# Altium schematic sheet Power_supply.SchDoc: SVPXFMC Carrier 3U
size A2; CheckedBy: \; Author: G.Kasprowicz; CompanyName: ISE; DrawnBy: T.Przywozki; Organization: WUT ISE; Address1: Warsaw University of Technology; Address2: Nowowiejska 15/19 00-665 Warsaw; Revision: 1.0.; SheetNumber: 2; SheetTotal: 20; Projet: SVPXFMC Carrier 3U; ModifiedBy: -; CheckedDate: -; Title2: Power Supply; DivGrp: ISE; Designer: G.Kasprowicz; Project: SVPXFMC Carrier 3U
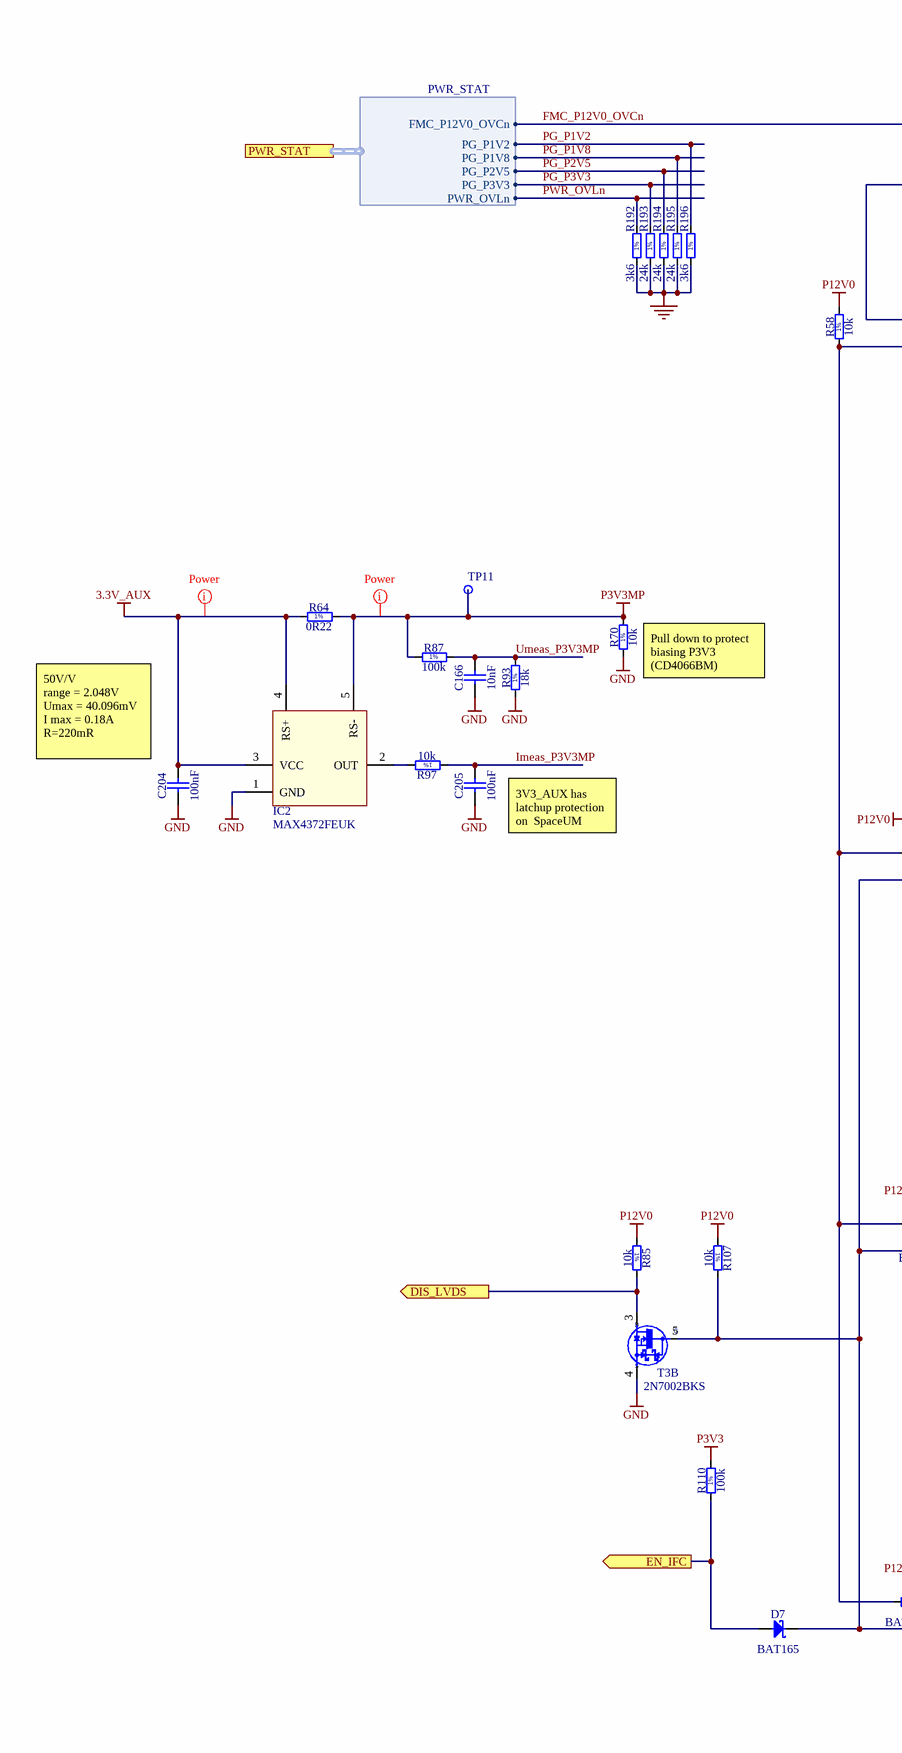
[diagram p0: Power_supply.SchDoc, left]
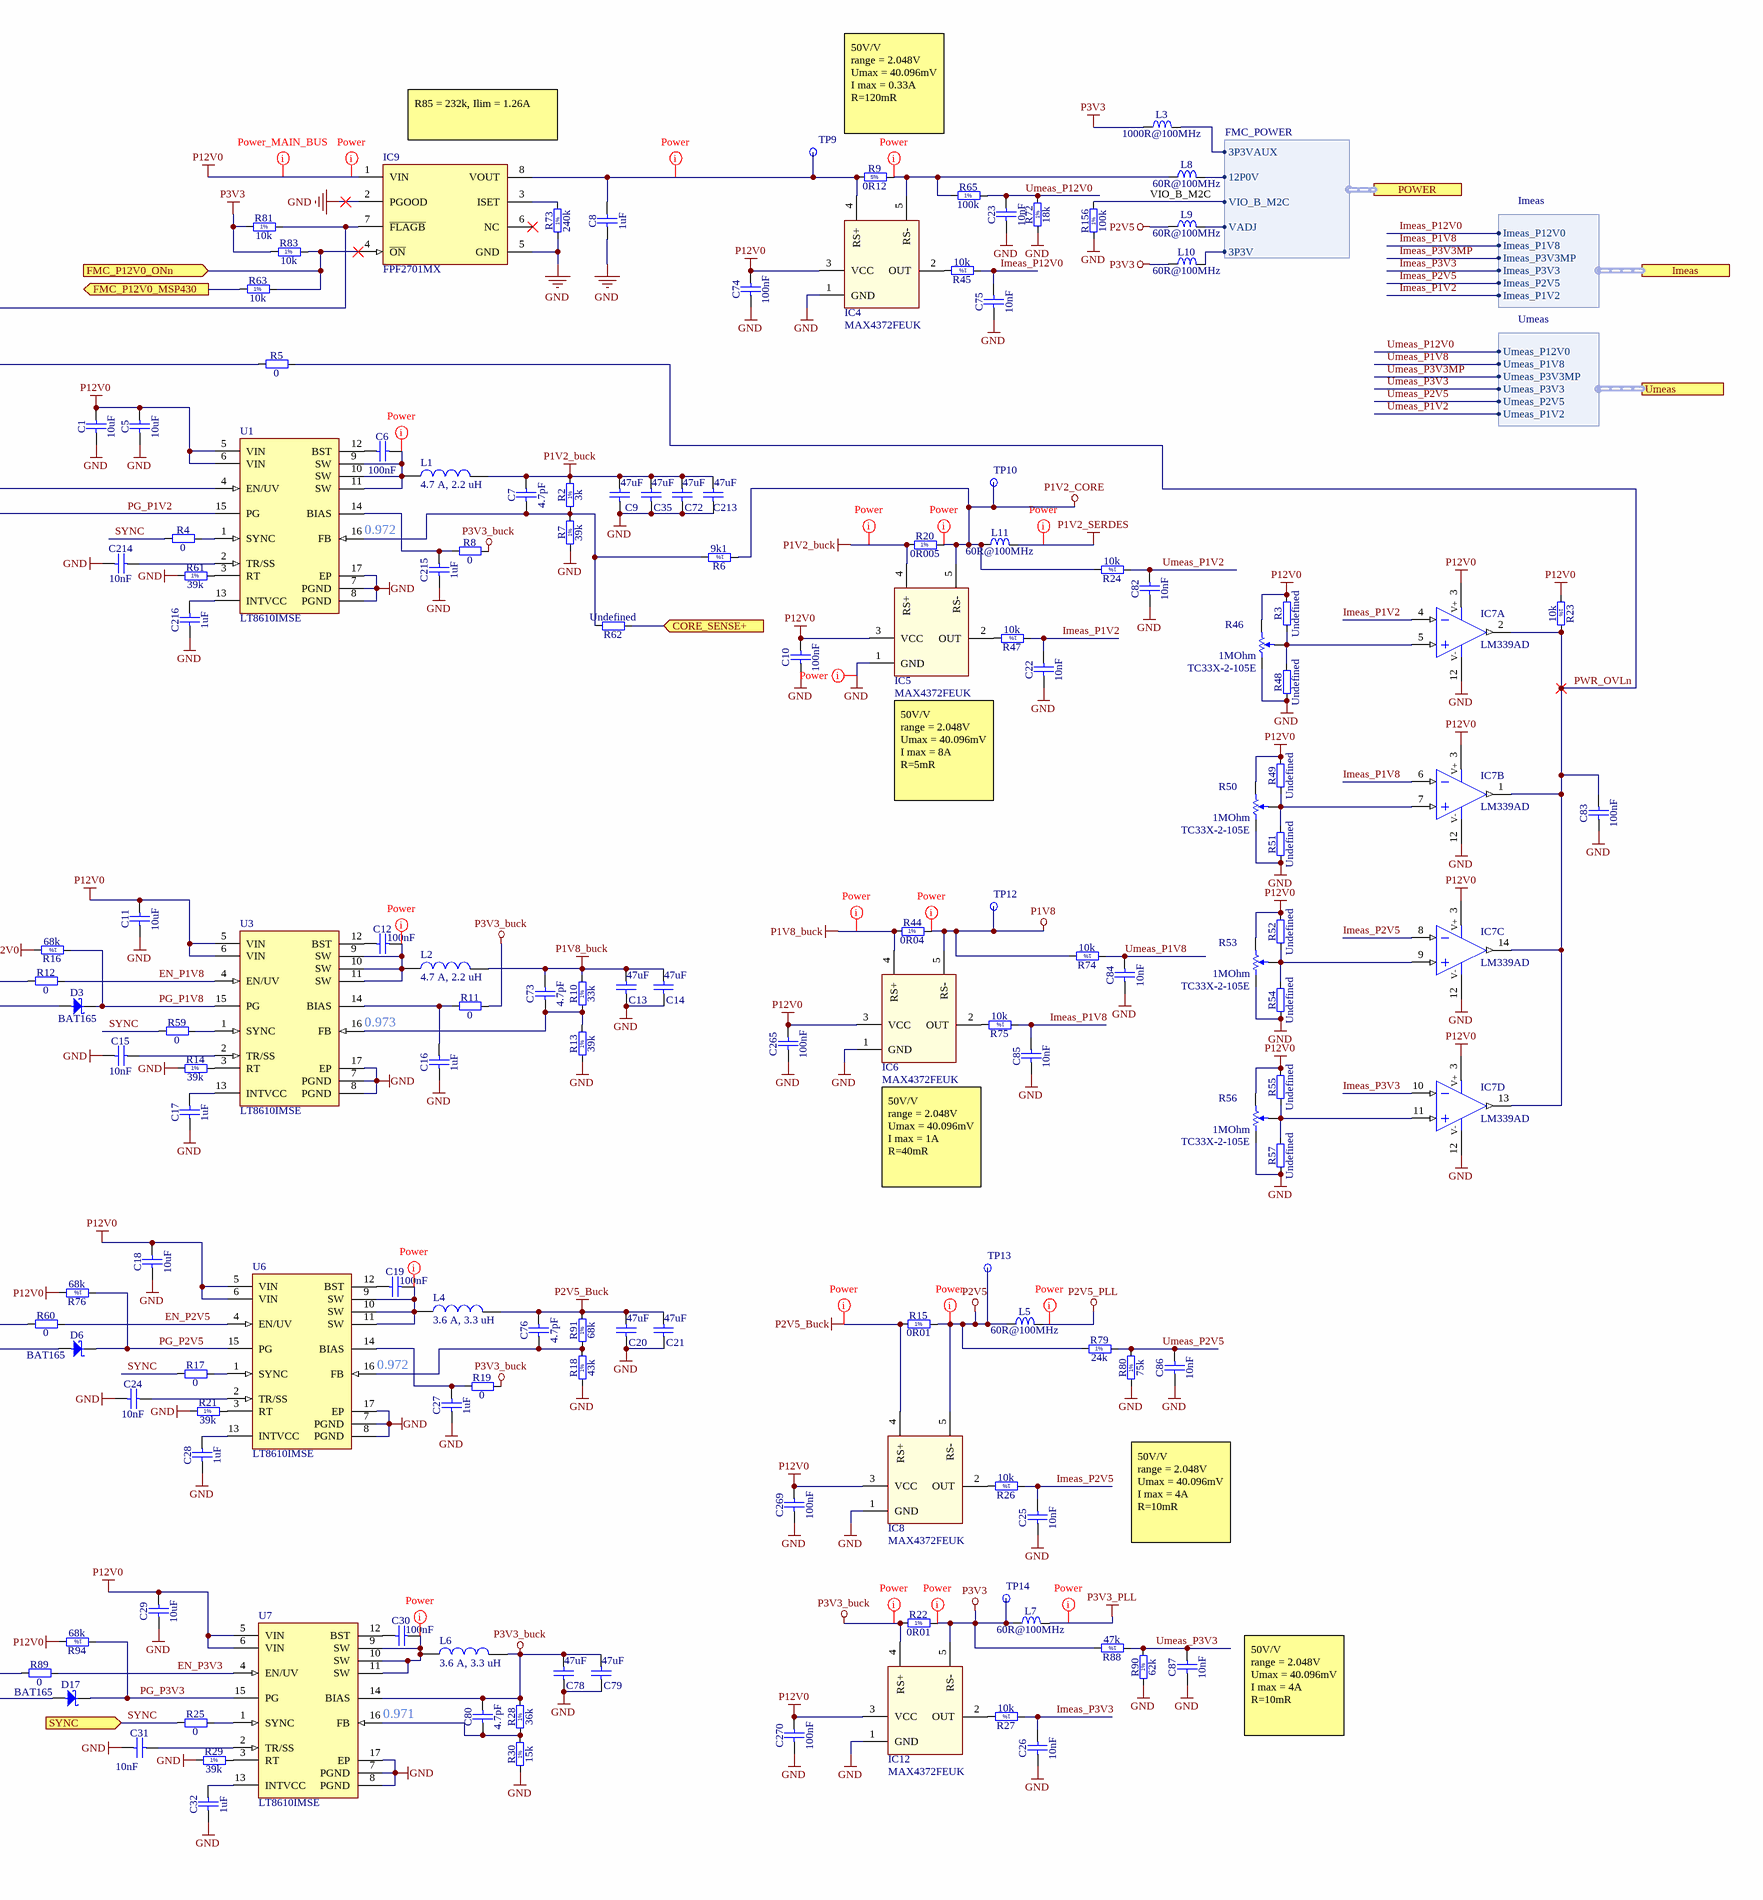
[diagram p1: Power_supply.SchDoc, right]

## Parts
C1  10uF  [CAPC2012X95N]
C5  10uF  [CAPC2012X95N]
C6  100nF  [CAPC1005X55N]
C7  4.7pF  [CAPC1005X55N]
C8  1uF  [CAPC1608X87N]
C9  47uF  [CAPC2012X140N]
C10  100nF  [CAPC1005X55N]
C11  10uF  [CAPC2012X95N]
C12  100nF  [CAPC1005X55N]
C13  47uF  [CAPC2012X140N]
C14  47uF  [CAPC2012X140N]
C15  10nF  [CAPC1005X55N]
C16  1uF  [CAPC1608X87N]
C17  1uF  [CAPC1608X87N]
C18  10uF  [CAPC2012X95N]
C19  100nF  [CAPC1005X55N]
C20  47uF  [CAPC2012X140N]
C21  47uF  [CAPC2012X140N]
C22  10nF  [CAPC1005X55N]
C23  10nF  [CAPC1005X55N]
C24  10nF  [CAPC1005X55N]
C25  10nF  [CAPC1005X55N]
C26  10nF  [CAPC1005X55N]
C27  1uF  [CAPC1608X87N]
C28  1uF  [CAPC1608X87N]
C29  10uF  [CAPC2012X95N]
C30  100nF  [CAPC1005X55N]
C31  10nF  [CAPC1005X55N]
C32  1uF  [CAPC1608X87N]
C35  47uF  [CAPC2012X140N]
C72  47uF  [CAPC2012X140N]
C73  4.7pF  [CAPC1005X55N]
C74  100nF  [CAPC1005X55N]
C75  10nF  [CAPC1005X55N]
C76  4.7pF  [CAPC1005X55N]
C78  47uF  [CAPC2012X140N]
C79  47uF  [CAPC2012X140N]
C80  4.7pF  [CAPC1005X55N]
C82  10nF  [CAPC1005X55N]
C83  100nF  [CAPC1005X55N]
C84  10nF  [CAPC1005X55N]
C85  10nF  [CAPC1005X55N]
C86  10nF  [CAPC1005X55N]
C87  10nF  [CAPC1005X55N]
C166  10nF  [CAPC1005X55N]
C204  100nF  [CAPC1005X55N]
C205  100nF  [CAPC1005X55N]
C213  47uF  [CAPC2012X140N]
C214  10nF  [CAPC1005X55N]
C215  1uF  [CAPC1608X87N]
C216  1uF  [CAPC1608X87N]
C265  100nF  [CAPC1005X55N]
C269  100nF  [CAPC1005X55N]
C270  100nF  [CAPC1005X55N]
D3  BAT165  [SOD2512X110N]
D6  BAT165  [SOD2512X110N]
D7  BAT165  [SOD2512X110N]
D17  BAT165  [SOD2512X110N]
IC2  MAX4372FEUK  [SOT95P270X145-5N]
IC4  MAX4372FEUK  [SOT95P270X145-5N]
IC5  MAX4372FEUK  [SOT95P270X145-5N]
IC6  MAX4372FEUK  [SOT95P270X145-5N]
IC7  LM339AD  [SOIC127P600X175-14N]  (parts A,B,C,D of 4)
IC8  MAX4372FEUK  [SOT95P270X145-5N]
IC9  FPF2701MX  [SOIC127P600X175-8N]
IC12  MAX4372FEUK  [SOT95P270X145-5N]
L1  4.7 A, 2.2 uH  [WE-MAIA_4020]
L2  4.7 A, 2.2 uH  [WE-MAIA_4020]
L3  1000R@100MHz  [INDC1608X95N]
L4  3.6 A, 3.3 uH  [WE-MAIA_4020]
L5  60R@100MHz  [INDC4516X180N]
L6  3.6 A, 3.3 uH  [WE-MAIA_4020]
L7  60R@100MHz  [INDC4516X180N]
L8  60R@100MHz  [INDC4516X180N]
L9  60R@100MHz  [INDC4516X180N]
L10  60R@100MHz  [INDC4516X180N]
L11  60R@100MHz  [INDC4516X180N]
R2  3k  [RESC1005X40N]
R3  Undefined  [RESC1005X40N]
R4  0  [RESC1005X40N]
R5  0  [RESC1005X40N]
R6  9k1  [RESC1005X40N]
R7  39k  [RESC1005X40N]
R8  0  [RESC1005X40N]
R9  0R12  [RESC2012X70N]
R10  33k  [RESC1005X40N]
R11  0  [RESC1005X40N]
R12  0  [RESC1005X40N]
R13  39k  [RESC1005X40N]
R14  39k  [RESC1005X40N]
R15  0R01  [RESC3216X80N]
R16  68k  [RESC1005X40N]
R17  0  [RESC1005X40N]
R18  43k  [RESC1005X40N]
R19  0  [RESC1005X40N]
R20  0R005  [RESC3216X80N]
R21  39k  [RESC1005X40N]
R22  0R01  [RESC3216X80N]
R23  10k  [RESC1005X40N]
R24  10k  [RESC1005X40N]
R25  0  [RESC1005X40N]
R26  10k  [RESC1005X40N]
R27  10k  [RESC1005X40N]
R28  36k  [RESC1005X40N]
R29  39k  [RESC1005X40N]
R30  15k  [RESC1005X40N]
R44  0R04  [RESC3216X89N]
R45  10k  [RESC1005X40N]
R46  TC33X-2-105E  Resistance: 1MOhm  [BOUR-TC33X-2_V]
R47  10k  [RESC1005X40N]
R48  Undefined  [RESC1005X40N]
R49  Undefined  [RESC1005X40N]
R50  TC33X-2-105E  Resistance: 1MOhm  [BOUR-TC33X-2_V]
R51  Undefined  [RESC1005X40N]
R52  Undefined  [RESC1005X40N]
R53  TC33X-2-105E  Resistance: 1MOhm  [BOUR-TC33X-2_V]
R54  Undefined  [RESC1005X40N]
R55  Undefined  [RESC1005X40N]
R56  TC33X-2-105E  Resistance: 1MOhm  [BOUR-TC33X-2_V]
R57  Undefined  [RESC1005X40N]
R58  10k  [RESC1005X40N]
R59  0  [RESC1005X40N]
R60  0  [RESC1005X40N]
R61  39k  [RESC1005X40N]
R62  Undefined  [RESC1005X40N]
R63  10k  [RESC1005X40N]
R64  0R22  [RESC3216X70N]
R65  100k  [RESC1005X40N]
R70  10k  [RESC1005X40N]
R72  18k  [RESC1005X40N]
R73  240k  [RESC1005X40N]
R74  10k  [RESC1005X40N]
R75  10k  [RESC1005X40N]
R76  68k  [RESC1005X40N]
R79  24k  [RESC1005X40N]
R80  75k  [RESC1005X40N]
R81  10k  [RESC1005X40N]
R83  10k  [RESC1005X40N]
R85  10k  [RESC1005X40N]
R87  100k  [RESC1005X40N]
R88  47k  [RESC1005X40N]
R89  0  [RESC1005X40N]
R90  62k  [RESC1005X40N]
R91  68k  [RESC1005X40N]
R93  18k  [RESC1005X40N]
R94  68k  [RESC1005X40N]
R97  10k  [RESC1005X40N]
R107  10k  [RESC1005X40N]
R110  100k  [RESC1005X40N]
R156  100k  [RESC1005X40N]
R192  3k6  [RESC1005X40N]
R193  24k  [RESC1005X40N]
R194  24k  [RESC1005X40N]
R195  24k  [RESC1005X40N]
R196  3k6  [RESC1005X40N]
T3  2N7002BKS  [SOT65P210X110-6N]  (part B of 2)
TP9  Test Point  [TPS127]  (value not drawn)
TP10  Test Point  [TPS127]  (value not drawn)
TP11  Test Point  [TPS127]  (value not drawn)
TP12  Test Point  [TPS127]  (value not drawn)
TP13  Test Point  [TPS127]  (value not drawn)
TP14  Test Point  [TPS127]  (value not drawn)
U1  LT8610IMSE  [LT-MSE-16-EDP_L]
U3  LT8610IMSE  [LT-MSE-16-EDP_L]
U6  LT8610IMSE  [LT-MSE-16-EDP_L]
U7  LT8610IMSE  [LT-MSE-16-EDP_L]

## Ports
CORE_SENSE+ (in), DIS_LVDS (out), EN_IFC (out), FMC_P12V0_MSP430 (out), FMC_P12V0_ONn (in), Imeas (harness Imeas), POWER (harness FMC_POWER), PWR_STAT (harness PWR_STAT), SYNC (in), Umeas (harness Umeas)

## Harnesses
Imeas: Imeas_P12V0, Imeas_P1V8, Imeas_P3V3, Imeas_P2V5, Imeas_P1V2, Imeas_P3V3MP
FMC_POWER: 3P3VAUX, 12P0V, VIO_B_M2C, VADJ, 3P3V
PWR_STAT: FMC_P12V0_OVCn, PG_P1V2, PG_P1V8, PG_P2V5, PG_P3V3, PWR_OVLn
Umeas: Umeas_P12V0, Umeas_P1V8, Umeas_P3V3, Umeas_P2V5, Umeas_P1V2, Umeas_P3V3MP

## Nets
3.3V_AUX: C204.2 IC2.3(VCC) IC2.4(RS+) R64.1
GND: C1.1 C5.1 C8.1 C9.1 C10.1 C11.1 C13.1 C14.1 C15.1 C16.1 C17.1 C18.1 C20.1 C21.1 C22.1 C23.1 C24.1 C25.1 C26.1 C27.1 C28.1 C29.1 C31.1 C32.1 C35.1 C72.1 C74.1 C75.1 C78.1 C79.1 C82.1 C83.1 C84.1 C85.1 C86.1 C87.1 C166.1 C204.1 C205.1 C213.1 C214.1 C215.1 C216.1 C265.1 C269.1 C270.1 IC2.1(GND) IC4.1(GND) IC5.1(GND) IC6.1(GND) IC7.12(V-) IC8.1(GND) IC9.2(PGOOD) IC9.5(GND) IC12.1(GND) R7.1 R13.1 R14.1 R18.1 R21.1 R29.1 R30.1 R46.1 R48.1 R50.1 R51.1 R53.1 R54.1 R56.1 R57.1 R61.1 R70.1 R72.1 R73.1 R80.1 R90.1 R93.1 R156.1 R192.1 R193.1 R194.1 R195.1 R196.1 T3.4(S) U1.7(PGND) U1.8(PGND) U1.17(EP) U3.7(PGND) U3.8(PGND) U3.17(EP) U6.7(PGND) U6.8(PGND) U6.17(EP) U7.7(PGND) U7.8(PGND) U7.17(EP)
P1V2_buck: C7.2 C9.2 C35.2 C72.2 C213.2 IC5.4(RS+) L1.2 R2.2 R20.1
P1V2_CORE: IC5.5(RS-) L11.1 R6.1 R20.2 R24.2 TP10.1
P1V2_SERDES: L11.2
P1V8: IC6.5(RS-) R44.2 R74.2 TP12.1
P1V8_buck: C13.2 C14.2 C73.2 IC6.4(RS+) L2.2 R10.2 R44.1
P2V5: IC8.5(RS-) L5.1 L9.1 R15.2 R79.1 TP13.1
P2V5_Buck: C20.2 C21.2 C76.2 IC8.4(RS+) L4.2 R15.1 R91.2
P2V5_PLL: L5.2
P3V3: IC12.5(RS-) L3.1 L7.1 L10.1 R22.2 R81.1 R83.1 R88.2 R110.2 TP14.1
P3V3_buck: C78.2 C79.2 C80.2 IC12.4(RS+) L6.2 R8.2 R11.2 R19.2 R22.1 R28.2 U7.14(BIAS)
P3V3_PLL: L7.2
P3V3MP: IC2.5(RS-) R64.2 R70.2 R87.1 TP11.1
P12V0: C1.2 C5.2 C10.2 C11.2 C18.2 C29.2 C74.2 C265.2 C269.2 C270.2 IC4.3(VCC) IC5.3(VCC) IC6.3(VCC) IC7.3(V+) IC8.3(VCC) IC9.1(VIN) IC12.3(VCC) R3.2 R16.2 R23.1 R46.3 R49.2 R50.3 R52.2 R53.3 R55.2 R56.3 R58.2 R76.2 R85.1 R94.2 R107.1 U1.5(VIN) U1.6(VIN) U3.5(VIN) U3.6(VIN) U6.5(VIN) U6.6(VIN) U7.5(VIN) U7.6(VIN)
CORE_SENSE+: R62.1 ; port CORE_SENSE+
DIS_LVDS: R85.2 T3.3(D) ; port DIS_LVDS
EN_IFC: D7.2(A) R110.1 ; port EN_IFC
EN_P1V8: R12.2 U3.4(EN/UV)
EN_P2V5: R60.2 U6.4(EN/UV)
EN_P3V3: R89.2 U7.4(EN/UV)
FMC_P12V0_MSP430: R63.1 ; port FMC_P12V0_MSP430
FMC_P12V0_ONn: IC9.4(~{ON}) R63.2 R83.2 ; port FMC_P12V0_ONn
FMC_P12V0_OVCn: IC9.7(~{FLAGB}) R81.2 ; port PWR_STAT.FMC_P12V0_OVCn
Imeas_P1V2: C22.2 IC7.4(IN-) R47.1 ; port Imeas.Imeas_P1V2
Imeas_P1V8: C85.2 IC7.6(IN-) R75.1 ; port Imeas.Imeas_P1V8
Imeas_P2V5: C25.2 IC7.8(IN-) R26.1 ; port Imeas.Imeas_P2V5
Imeas_P3V3: C26.2 IC7.10(IN-) R27.1 ; port Imeas.Imeas_P3V3
Imeas_P3V3MP: C205.2 R97.1 ; port Imeas.Imeas_P3V3MP
Imeas_P12V0: C75.2 R45.1 ; port Imeas.Imeas_P12V0
PG_P1V2: R12.1 R58.1 R60.1 R89.1 R196.2 U1.15(PG) ; port PWR_STAT.PG_P1V2
PG_P1V8: D3.1(C) R16.1 R195.2 U3.15(PG) ; port PWR_STAT.PG_P1V8
PG_P2V5: D6.1(C) R76.1 R194.2 U6.15(PG) ; port PWR_STAT.PG_P2V5
PG_P3V3: D17.1(C) R94.1 R193.2 U7.15(PG) ; port PWR_STAT.PG_P3V3
PWR_OVLn: C83.2 IC7.1(OUT) IC7.2(OUT) IC7.13(OUT) IC7.14(OUT) R5.2 R23.2 R192.2 ; port PWR_STAT.PWR_OVLn
SYNC: R4.1 R17.1 R25.1 R59.1 ; port SYNC
Umeas_P1V2: C82.2 R24.1 ; port Umeas.Umeas_P1V2
Umeas_P1V8: C84.2 R74.1 ; port Umeas.Umeas_P1V8
Umeas_P2V5: C86.2 R79.2 R80.2 ; port Umeas.Umeas_P2V5
Umeas_P3V3: C87.2 R88.1 R90.2 ; port Umeas.Umeas_P3V3
Umeas_P3V3MP: C166.2 R87.2 R93.2 ; port Umeas.Umeas_P3V3MP
Umeas_P12V0: C23.2 R65.2 R72.2 ; port Umeas.Umeas_P12V0
VIO_B_M2C: R156.2 ; port POWER.VIO_B_M2C
NetC6_1: C6.1 U1.12(BST)
NetC6_2: C6.2 L1.1 U1.9(SW) U1.10(SW) U1.11(SW)
NetC7_1: C7.1 R2.1 R6.2 R7.2 R62.2 U1.16(FB)
NetC8_2: C8.2 IC4.4(RS+) IC9.8(VOUT) R9.1 TP9.1
NetC12_1: C12.1 U3.12(BST)
NetC12_2: C12.2 L2.1 U3.9(SW) U3.10(SW) U3.11(SW)
NetC15_2: C15.2 U3.2(TR/SS)
NetC16_2: C16.2 R11.1 U3.14(BIAS)
NetC17_2: C17.2 U3.13(INTVCC)
NetC19_1: C19.1 U6.12(BST)
NetC19_2: C19.2 L4.1 U6.9(SW) U6.10(SW) U6.11(SW)
NetC24_2: C24.2 U6.2(TR/SS)
NetC27_2: C27.2 R19.1 U6.14(BIAS)
NetC28_2: C28.2 U6.13(INTVCC)
NetC30_1: C30.1 U7.12(BST)
NetC30_2: C30.2 L6.1 U7.9(SW) U7.10(SW) U7.11(SW)
NetC31_2: C31.2 U7.2(TR/SS)
NetC32_2: C32.2 U7.13(INTVCC)
NetC73_1: C73.1 R10.1 R13.2 U3.16(FB)
NetC76_1: C76.1 R18.2 R91.1 U6.16(FB)
NetC80_1: C80.1 R28.1 R30.2 U7.16(FB)
NetC214_2: C214.2 U1.2(TR/SS)
NetC215_2: C215.2 R8.1 U1.14(BIAS)
NetC216_2: C216.2 U1.13(INTVCC)
NetD3_2: D3.2(A) D6.2(A) D7.1(C) D17.2(A) R107.2 T3.5(G)
NetIC2_2: IC2.2(OUT) R97.2
NetIC4_2: IC4.2(OUT) R45.2
NetIC4_5: IC4.5(RS-) L8.1 R9.2 R65.1
NetIC5_2: IC5.2(OUT) R47.2
NetIC6_2: IC6.2(OUT) R75.2
NetIC7_5: IC7.5(IN+) R3.1 R46.2 R48.2
NetIC7_7: IC7.7(IN+) R49.1 R50.2 R51.2
NetIC7_9: IC7.9(IN+) R52.1 R53.2 R54.2
NetIC7_11: IC7.11(IN+) R55.1 R56.2 R57.2
NetIC8_2: IC8.2(OUT) R26.2
NetIC9_3: IC9.3(ISET) R73.2
NetIC12_2: IC12.2(OUT) R27.2
NetL3_2: L3.2 ; port POWER.3P3VAUX
NetL8_2: L8.2 ; port POWER.12P0V
NetL9_2: L9.2 ; port POWER.VADJ
NetL10_2: L10.2 ; port POWER.3P3V
NetR4_2: R4.2 U1.1(SYNC)
NetR5_1: R5.1 U1.4(EN/UV)
NetR14_2: R14.2 U3.3(RT)
NetR17_2: R17.2 U6.1(SYNC)
NetR21_2: R21.2 U6.3(RT)
NetR25_2: R25.2 U7.1(SYNC)
NetR29_2: R29.2 U7.3(RT)
NetR59_2: R59.2 U3.1(SYNC)
NetR61_2: R61.2 U1.3(RT)

Not connected (* = marked no-connect by the designer): IC9 6(NC)*

## Layout directives
net class Power: 3.3V_AUX, GND, NetC6_2, NetC8_2, NetC12_2, NetC19_2, NetC30_2, NetIC4_5, P1V2_buck, P1V2_CORE, P1V2_SERDES, P1V8, P1V8_buck, P2V5, P2V5_Buck, P2V5_PLL, P3V3, P3V3_buck, P3V3_PLL, P3V3MP, P12V0
net class Power_MAIN_BUS: P12V0

## Notes on the sheet
- 50V/V
  range = 2.048V
  Umax = 40.096mV
  I max = 0.33A
  R=120mR
- (near IC9) R85 = 232k, Ilim = 1.26A
- (near U1) 0.972
- (near R70) Pull down to protect biasing P3V3 (CD4066BM)
- 50V/V
  range = 2.048V
  Umax = 40.096mV
  I max = 8A
  R=5mR
- (near C204) 50V/V
  range = 2.048V
  Umax = 40.096mV
  I max = 0.18A
  R=220mR
- (near C205) 3V3_AUX has latchup protection on  SpaceUM
- (near U3) 0.973
- 50V/V
  range = 2.048V
  Umax = 40.096mV
  I max = 1A
  R=40mR
- (near U6) 0.972
- 50V/V
  range = 2.048V
  Umax = 40.096mV
  I max = 4A
  R=10mR
- (near U7) 0.971
- Project/Equipment
- Document
- Designer
- Drawn by
- Check.by
- Last Mod.
- Copyright WUT ISE 2019
  This documentation describes Open Hardware and is licensed under the CERN OHL v.1.1. You may redistribute and modify this documentation under the terms of the CERN OHL v1.1.
  (http://ohwr.org/CERNOHL). This documentation is dristributed WITHOUT ANY EXPRESS OR IMPLIED WARRANTY, INCLUDING OF MERCHANTABILITY, SATISFACTORY QUALITY AND FITNESS FOR A PARTICULAR PURPOSE. Please see the CERN OHL v.1.1 for applicable conditions
- File
- Print Date
- Sheet
- Size
- A2
- of
- Rev
- (in symbol R0402_3K6_1%_0.0625W_100PPM) 1%
- (in symbol R0402_3K_1%_0.0625W_100PPM) 1%
- (in symbol R0402_9K1_1%_0.0625W_100PPM) 1%
- (in symbol R0402_10K_1%_0.0625W_100PPM) 1%
- (in symbol R0402_15K_1%_0.0625W_100PPM) 1%
- (in symbol R0402_18K_1%_0.0625W_100PPM) 1%
- (in symbol R0402_24K_1%_0.0625W_100PPM) 1%
- (in symbol R0402_33K_1%_0.0625W_100PPM) 1%
- (in symbol R0402_36K_1%_0.0625W_100PPM) 1%
- (in symbol R0402_39K_1%_0.0625W_100PPM) 1%
- (in symbol R0402_43K_1%_0.0625W_100PPM) 1%
- (in symbol R0402_47K_1%_0.0625W_100PPM) 1%
- (in symbol R0402_62K_1%_0.0625W_100PPM) 1%
- (in symbol R0402_68K_1%_0.0625W_100PPM) 1%
- (in symbol R0402_75K_1%_0.0625W_100PPM) 1%
- (in symbol R0402_100K_1%_0.0625W_100PPM) 1%
- (in symbol R0402_240K_1%_0.0625W_100PPM) 1%
- (in symbol R0805_0R12_5%_0.25W_250PPM_PANASONIC_ERJ) 5%
- (in symbol R1206_0R01_1%_1W_100PPM_TT_LRMAM1206) 1%
- (in symbol R1206_0R04_1%_0.5W_100PPM_VISHAY_WSL) 1%
- (in symbol R1206_0R005_1%_1W_100PPM_TT_LRMAM1206) 1%
- (in symbol R1206_0R22_1%_0.5W_100PPM) 1%

## Library data of the parts
C1 C5 C11 C18 C29 = CC0805_10UF_25V_10%_X5R: Non-polarised capacitor; Part Description: SMD Multilayer Chip Ceramic Capacitor; Manufacturer: GENERIC; Manufacturer1 Part Number: GRM219R61E106KA12D; Voltage: 25V; TC: X5R; Tolerance: ±10%; Part Number: CC0805_10UF_25V_10%_X5R; Component Kind: Standard; Component Type: Standard; Pin Count: 2; Value: 10uF; Status: Preferred; Manufacturer Part Number: CC0805_10UF_25V_10%_X5R; Case: 0805; Mounted: Yes; Socket: No; SMD: Yes; Sense: No; Manufacturer1 Example: MURATA; Manufacturer1 ComponentHeight: 0.95mm; HelpURL: \\cern.ch\dfs\Applications\Altium\Datasheets\CC0805_X5R_MURATA_GRM.pdf; Author: CERN DEM JLC; CreateDate: 25/10/2012; LatestRevisionDate: 06/09/2016
C6 C10 C12 C19 C30 C74 C83 C204 C205 C265 C269 C270 = CC0402_100NF_25V_10%_X7R_YUDEN_TMK105B7104KVHF: Non-polarised capacitor; Part Description: SMD Multilayer Chip Ceramic Capacitor (High Dielectric Type) for Automotive / Industrial Applications; Manufacturer: TAIYO YUDEN; Voltage: 25V; TC: X7R; Tolerance: ±10%; Part Number: CC0402_100NF_25V_10%_X7R_YUDEN_TMK105B7104KVHF; Component Kind: Standard; Component Type: Standard; Pin Count: 2; Value: 100nF; Status: Not Recommended; Manufacturer Part Number: TMK105B7104KVHF; Case: 0402; Mounted: Yes; Socket: No; SMD: Yes; Sense: No; ComponentHeight: 0.55mm; HelpURL: \\cern.ch\dfs\Applications\Altium\Datasheets\CC0402_TAIYO-YUDEN_TMK105B7104KVHF.pdf; Author: CERN DEM JLC; CreateDate: 10/05/2017; LatestRevisionDate: 10/05/2017
C7 C73 C76 C80 = CC0402_4.7PF_50V_0.25PF_C0G: Non-polarised capacitor; Part Description: SMD Multilayer Chip Ceramic Capacitor; Manufacturer: GENERIC; Manufacturer1 Part Number: C0402C479C5GACTU; Voltage: 50V; TC: C0G/NP0; Tolerance: ±0.25pF; Part Number: CC0402_4.7PF_50V_0.25PF_C0G; Component Kind: Standard; Component Type: Standard; Pin Count: 2; Value: 4.7pF; Status: Preferred; Manufacturer Part Number: CC0402_4.7PF_50V_0.25PF_C0G; Case: 0402; Mounted: Yes; Socket: No; SMD: Yes; Sense: No; Manufacturer1 Example: KEMET; Manufacturer1 ComponentHeight: 0.55mm; HelpURL: \\cern.ch\dfs\Applications\Altium\Datasheets\CC0805_C0G_KEMET_(Commercial Grade).pdf; Author: CERN DEM JLC; CreateDate: 03/12/2007; LatestRevisionDate: 22/04/2015
C8 C16 C17 C27 C28 C32 C215 C216 = CC0603_1UF_25V_10%_X7R: Non-polarised capacitor; Part Description: SMD Multilayer Chip Ceramic Capacitor; Manufacturer: GENERIC; Manufacturer1 Part Number: GRM188R71E105KA12D; Voltage: 25V; TC: X7R; Tolerance: ±10%; Part Number: CC0603_1UF_25V_10%_X7R; Component Kind: Standard; Component Type: Standard; Pin Count: 2; Value: 1uF; Status: None; Manufacturer Part Number: CC0603_1UF_25V_10%_X7R; Case: 0603; Mounted: Yes; Socket: No; SMD: Yes; Sense: No; Manufacturer1 Example: MURATA; Manufacturer1 ComponentHeight: 0.9mm; HelpURL: \\cern.ch\dfs\Applications\Altium\Datasheets\CC0603_X7R_MURATA.pdf; Author: CERN DEM JLC; CreateDate: 18/01/2011; LatestRevisionDate: 18/01/2011
C9 C13 C14 C20 C21 C35 C72 C78 C79 C213 = CC0805_47UF_6.3V_20%_X5R: Non-polarised capacitor; Manufacturer: GENERIC; Part Description: SMD Multilayer Chip Ceramic Capacitor; Manufacturer1 Part Number: C0805C476M9PACTU; Voltage: 6.3V; TC: X5R; Tolerance: ±20%; Part Number: CC0805_47UF_6.3V_20%_X5R; Component Kind: Standard; Component Type: Standard; Pin Count: 2; Value: 47uF; Status: Preferred; Manufacturer Part Number: CC0805_47UF_6.3V_20%_X5R; Case: 0805; Mounted: Yes; Socket: No; SMD: Yes; Sense: No; Manufacturer1 Example: KEMET; Manufacturer1 ComponentHeight: 1.4mm; HelpURL: \\cern.ch\dfs\Applications\Altium\Datasheets\CC0805_X5R_KEMET.pdf; Author: CERN DEM JLC; CreateDate: 16/10/2012; LatestRevisionDate: 16/10/2012
C15 C24 C31 C214 = CC0402_10NF_25V_10%_X7R: Non-polarised capacitor; Part Description: SMD Multilayer Chip Ceramic Capacitor; Manufacturer: GENERIC; Manufacturer1 Part Number: C1005X7R1E103KT; Voltage: 25V; TC: X7R; Tolerance: ±10%; Part Number: CC0402_10NF_25V_10%_X7R; Component Kind: Standard; Component Type: Standard; Pin Count: 2; Value: 10nF; Status: Preferred; Manufacturer Part Number: CC0402_10NF_25V_10%_X7R; Case: 0402; Mounted: Yes; Socket: No; SMD: Yes; Sense: No; Manufacturer1 Example: TDK; Manufacturer1 ComponentHeight: 0.55mm; HelpURL: \\cern.ch\dfs\Applications\Altium\Datasheets\CC0402_X7R_TDK_C.pdf; Author: CERN DEM JLC; CreateDate: 25/10/2012; LatestRevisionDate: 25/10/2012
C22 C23 C25 C26 C75 C82 C84-C87 C166 = CC0402_10NF_50V_10%_X7R: Non-polarised capacitor; Part Description: SMD Multilayer Chip Ceramic Capacitor; Manufacturer: GENERIC; Manufacturer1 Part Number: GRM155R71H103KA88D; Voltage: 50V; TC: X7R; Tolerance: ±10%; Part Number: CC0402_10NF_50V_10%_X7R; Component Kind: Standard; Component Type: Standard; Pin Count: 2; Value: 10nF; Status: None; Manufacturer Part Number: CC0402_10NF_50V_10%_X7R; Case: 0402; Mounted: Yes; Socket: No; SMD: Yes; Sense: No; Manufacturer1 Example: MURATA; Manufacturer1 ComponentHeight: 0.55mm; HelpURL: \\cern.ch\dfs\Applications\Altium\Datasheets\CC0402_X7R_MURATA_GRM.pdf; Author: CERN DEM MR; CreateDate: 08/01/2016; LatestRevisionDate: 08/01/2016
D3 D6 D7 D17 = BAT165: Schottky Diode; Part Description: Medium Power AF Schottky Diode; Manufacturer: INFINEON; Voltage: 40V; Power: 750mA; PressFit: No; Bonding: No; Part Number: BAT165; Component Kind: Standard; Component Type: Standard; Device: BAT165; PackageDescription: Small Outline Diode Flat Lead (SOD-323), 1.70mm W X 1.25mm L X 1.10mm H body,  IPC Medium Density; Manufacturer Part Number: BAT165; Pin Count: 2; Case: SOD323; Mounted: Yes; Socket: No; SMD: Yes; Sense: No; ComponentHeight: 1.1mm; HelpURL: \\cern.ch\dfs\Applications\Altium\Datasheets\BAT165.pdf; Author: CERN DEM JLC; CreateDate: 2014-11-12; LatestRevisionDate: 2014-11-12
IC2 = MAX4372FEUK: High side current sense amplifier (x50); Manufacturer: Maxim; Bonding: No; PressFit: No; Case: SOT23-5; Component Kind: Standard; Component Type: Standard; ComponentHeigth: *; CreateDate: 2018-01-01; Device: MAX4372FEUK; Footprint: SOT23-5; HelpURL: *; LatestRevisionDate: 2018-01-01; Manufacturer Part Number: MAX4372FEUK; Mounted: Yes; PackageDescription: SOT23-5; Part Description: High side current sense amplifier (x50); Part Number: MAX4372FEUK; Pin Count: 5; Sense: No; SMD: Yes; Socket: No; Value: *
IC4-IC6 IC8 IC12 = PM_MAX4372FEUK: Manufacturer: Maxim; Part Description: High side current sense amplifier (x50); Bonding: No; PressFit: No; Case: SOT23-5; Component Kind: Standard; Component Type: Standard; ComponentHeigth: *; CreateDate: 2018-01-01; Device: MAX4372FEUK; Footprint: SOT23-5; HelpURL: *; LatestRevisionDate: 2018-01-01; Manufacturer Part Number: MAX4372FEUK; Mounted: Yes; PackageDescription: SOT23-5; Part Number: MAX4372FEUK; Pin Count: 5; Sense: No; SMD: Yes; Socket: No; Value: MAX4372FEUK
IC7 = LM339AD: Quad Operational Amplifier; Part Description: Quad Differential Comparator; Manufacturer: TEXAS INSTRUMENTS; PressFit: No; Bonding: No; Part Number: LM339AD; Component Kind: Standard; Component Type: Standard; Device: LM339AD; PackageDescription: SOIC 14, Pitch 1.27mm - Body 4x8.75mm, IPC Medium Density; Manufacturer Part Number: LM339AD; Pin Count: 14; Case: SOIC14; Mounted: Yes; Socket: No; SMD: Yes; Sense: No; ComponentHeight: 1.75mm; Author: CERN DEM JLC; HelpURL: \\cern.ch\dfs\Applications\Altium\Datasheets\LM339AD.pdf; CreateDate: 09/03/2011; LatestRevisionDate: 09/03/2011
IC9 = FPF2701MX: Adjustable Over-current Protection Load Switch; Manufacturer: ON Semiconductor; Bonding: No; ComponentHeigth: 1.75; PressFit: No; Case: SO-8; Component Kind: Standard; Component Type: Standard; CreateDate: 2018-05-24; Device: FPF2701MX; HelpURL: http://www.onsemi.com/pub/Collateral/FPF2702-D.pdf; LatestRevisionDate: 2018-05-24; Manufacturer Part Number: FPF2701MX; Mounted: Yes; PackageDescription: *; Part Description: Adjustable Over-current Protection Load Switch; Part Number: FPF2701MX; Pin Count: 8; Sense: No; SMD: Yes; Socket: No
L1 L2 = 78438356022: WE-MAIA SMD Power Inductor, size 4020, 4.7 A, 2.2 uH; Rated Current: 4.7 A; Inductance: 2.2 uH; DC Resistance max.: 35 mOhm; ComponentLink1Description: Manufacturer; ComponentLink1URL: http://www.we-online.de; ComponentLink2Description: Datasheet; ComponentLink2URL: http://katalog.we-online.de/pbs/datasheet/78438356022.pdf; Part Number: 78438356022; Published Date: Nov. 2017; Publisher: Wurth Elektronik; Size: 4020; Operating Temperature: -40 to 125 degC
L3 = IND0603_MURATA_BLM18HE102SN1: Inductor; Part Description: SMD EMIFIL Suppression Chip Ferrite Bead; Manufacturer: MURATA; Power: 600mA; Resistance: 0.35R; Tolerance: ±25%; Part Number: IND0603_MURATA_BLM18HE102SN1; Component Kind: Standard; Component Type: Standard; Pin Count: 2; Value: 1000R@100MHz; Status: None; Manufacturer Part Number: BLM18HE102SN1; Case: 0603; Mounted: Yes; Socket: No; SMD: Yes; Sense: No; ComponentHeight: 0.95mm; HelpURL: \\cern.ch\dfs\Applications\Altium\Datasheets\IND0603_MURATA_BLM18H.pdf; Author: CERN DEM JLC; CreateDate: 09/12/2013; LatestRevisionDate: 09/12/2013
L4 L6 = 78438356033: WE-MAIA SMD Power Inductor, size 4020, 3.6 A, 3.3 uH; Rated Current: 3.6 A; Inductance: 3.3 uH; DC Resistance max.: 48 mOhm; ComponentLink1Description: Manufacturer; ComponentLink1URL: http://www.we-online.de; ComponentLink2Description: Datasheet; ComponentLink2URL: http://katalog.we-online.de/pbs/datasheet/78438356033.pdf; Part Number: 78438356033; Published Date: Nov. 2017; Publisher: Wurth Elektronik; Size: 4020; Operating Temperature: -40 to 125 degC
L5 L7-L11 = IND1806_MURATA_BLM41PG600SN1L: Inductor; Part Description: SMD EMI Suppression Chip Ferrite Bead (BLM41P Series); Manufacturer: MURATA; Power: 6A; Resistance: 0.01R; Part Number: IND1806_MURATA_BLM41PG600SN1L; Component Kind: Standard; Component Type: Standard; Pin Count: 2; Value: 60R@100MHz; Status: None; Manufacturer Part Number: BLM41PG600SN1L; Case: 1806; Mounted: Yes; Socket: No; SMD: Yes; Sense: No; ComponentHeight: 1.8mm; HelpURL: \\cern.ch\dfs\Applications\Altium\Datasheets\IND1806_MURATA_BLM41P.pdf; Author: CERN DEM JLC; CreateDate: 02/12/2009; LatestRevisionDate: 02/12/2009
R2 = R0402_3K_1%_0.0625W_100PPM: Resistor - 1%; Part Description: General Purpose Thick Film Chip Resistor; Manufacturer: GENERIC; Manufacturer1 Part Number: 232270673002L; TC: ±100ppm/°C; PressFit: No; Part Number: R0402_3K_1%_0.0625W_100PPM; Component Kind: Standard; Component Type: Standard; Pin Count: 2; Value: 3k; Status: Not Recommended; Power: 0.0625W; Tolerance: ±1%; Manufacturer Part Number: R0402_3K_1%_0.0625W_100PPM; Case: 0402; Mounted: Yes; Sense: No; Socket: No; SMD: Yes; Manufacturer1 Example: YAGEO PHYCOMP; Manufacturer1 ComponentHeight: 0.4mm; HelpURL: \\cern.ch\dfs\Applications\Altium\Datasheets\R0402_Phycomp_RC0402.pdf; Author: CERN DEM JLC; CreateDate: 03/12/2007; LatestRevisionDate: 17/10/2012
R3 R48 R49 R51 R52 R54 R55 R57 R62 = R0402_NO-VALUE: Resistor; Part Description: Reserved Footprint For a 0402 (1005) Chip Resistor; PressFit: No; Mounted: No; Part Number: R0402_NO-VALUE; Component Kind: Standard; Component Type: Standard; Pin Count: 2; Value: Undefined; Status: None; Manufacturer: Undefined; Manufacturer Part Number: R0402_NO-VALUE; Case: 0402; Sense: No; Socket: No; SMD: Yes; Manufacturer1 Example: Undefined; Manufacturer1 Part Number: Undefined; Manufacturer1 ComponentHeight: Undefined; HelpURL: Undefined; Author: CERN DEM JLC; CreateDate: 03/12/2007; LatestRevisionDate: 13/03/2008
R4 R5 R8 R11 R12 R17 R19 R25 R59 R60 R89 = R0402_0R_JUMPER: Resistor; Part Description: 1A (0.05R Max DC Resistance) Zero Ohm Jumper; Manufacturer: GENERIC; Manufacturer1 Part Number: 232270591001L; PressFit: No; Part Number: R0402_0R_JUMPER; Component Kind: Standard; Component Type: Standard; Pin Count: 2; Value: 0; Status: Not Recommended; Manufacturer Part Number: R0402_0R_JUMPER; Case: 0402; Mounted: Yes; Sense: No; Socket: No; SMD: Yes; Manufacturer1 Example: YAGEO PHYCOMP; Manufacturer1 ComponentHeight: 0.4mm; HelpURL: \\cern.ch\dfs\Applications\Altium\Datasheets\R0402_Phycomp_RC0402.pdf; Author: CERN DEM JLC; CreateDate: 03/12/2007; LatestRevisionDate: 17/10/2012
R6 = R0402_9K1_1%_0.0625W_100PPM: Resistor - 1%; Part Description: General Purpose Thick Film Chip Resistor; Manufacturer: GENERIC; Manufacturer1 Part Number: 232270679102L; TC: ±100ppm/°C; PressFit: No; Part Number: R0402_9K1_1%_0.0625W_100PPM; Component Kind: Standard; Component Type: Standard; Pin Count: 2; Value: 9k1; Status: Not Recommended; Power: 0.0625W; Tolerance: ±1%; Manufacturer Part Number: R0402_9K1_1%_0.0625W_100PPM; Case: 0402; Mounted: Yes; Sense: No; Socket: No; SMD: Yes; Manufacturer1 Example: YAGEO PHYCOMP; Manufacturer1 ComponentHeight: 0.4mm; HelpURL: \\cern.ch\dfs\Applications\Altium\Datasheets\R0402_Phycomp_RC0402.pdf; Author: CERN DEM JLC; CreateDate: 03/12/2007; LatestRevisionDate: 17/10/2012
R7 R13 R14 R21 R29 R61 = R0402_39K_1%_0.0625W_100PPM: Resistor - 1%; Part Description: General Purpose Thick Film Chip Resistor; Manufacturer: GENERIC; Manufacturer1 Part Number: 232270673903; TC: ±100ppm/°C; PressFit: No; Part Number: R0402_39K_1%_0.0625W_100PPM; Component Kind: Standard; Component Type: Standard; Pin Count: 2; Value: 39k; Status: Not Recommended; Power: 0.0625W; Tolerance: ±1%; Manufacturer Part Number: R0402_39K_1%_0.0625W_100PPM; Case: 0402; Mounted: Yes; Sense: No; Socket: No; SMD: Yes; Manufacturer1 Example: YAGEO PHYCOMP; Manufacturer1 ComponentHeight: 0.4mm; HelpURL: \\cern.ch\dfs\Applications\Altium\Datasheets\R0402_Phycomp_RC0402.pdf; Author: CERN DEM JLC; CreateDate: 03/12/2007; LatestRevisionDate: 17/10/2012
R9 = R0805_0R12_5%_0.25W_250PPM_PANASONIC_ERJ: Resistor - 5%; Part Description: Low Resistance Thick Film Chip Resistor; Manufacturer Part Number: ERJ6BSJR12V; Power: 0.25W; TC: ±250ppm/°C; PressFit: No; Part Number: R0805_0R12_5%_0.25W_250PPM_PANASONIC_ERJ; Component Kind: Standard; Component Type: Standard; Pin Count: 2; Value: 0R12; Status: Not Recommended; Tolerance: ±5%; Manufacturer: PANASONIC; Case: 0805; Mounted: Yes; Sense: No; Socket: No; SMD: Yes; ComponentHeight: 0.7mm; HelpURL: \\cern.ch\dfs\Applications\Altium\Datasheets\R0805_PANASONIC_ERJ.pdf; Author: CERN DEM JLC; CreateDate: 19/12/2011; LatestRevisionDate: 19/12/2011
R10 = R0402_33K_1%_0.0625W_100PPM: Resistor - 1%; Part Description: General Purpose Thick Film Chip Resistor; Manufacturer: GENERIC; Manufacturer1 Part Number: 232270673303L; TC: ±100ppm/°C; PressFit: No; Part Number: R0402_33K_1%_0.0625W_100PPM; Component Kind: Standard; Component Type: Standard; Pin Count: 2; Value: 33k; Status: Not Recommended; Power: 0.0625W; Tolerance: ±1%; Manufacturer Part Number: R0402_33K_1%_0.0625W_100PPM; Case: 0402; Mounted: Yes; Sense: No; Socket: No; SMD: Yes; Manufacturer1 Example: YAGEO PHYCOMP; Manufacturer1 ComponentHeight: 0.4mm; HelpURL: \\cern.ch\dfs\Applications\Altium\Datasheets\R0402_Phycomp_RC0402.pdf; Author: CERN DEM JLC; CreateDate: 03/12/2007; LatestRevisionDate: 17/10/2012
R15 R22 = R1206_0R01_1%_1W_100PPM_TT_LRMAM1206: Resistor - 1%; Part Description: Low Value Metal Alloy Resistor; Manufacturer: TT Electronics; Manufacturer Part Number: LRMAM1206-R01FT5; Power: 1W; TC: ±100ppm/°C; PressFit: No; Part Number: R1206_0R01_1%_1W_100PPM_TT_LRMAM1206; Component Kind: Standard; Component Type: Standard; Pin Count: 2; Value: 0R01; Status: Not Recommended; Tolerance: ±1%; Case: 1206; Mounted: Yes; Sense: No; Socket: No; SMD: Yes; ComponentHeight: 0.8mm; HelpURL: \\cern.ch\dfs\Applications\Altium\Datasheets\R1206_TT ELECTRONICS_LRMA.pdf; Author: CERN DEM BC; CreateDate: 29/07/2015; LatestRevisionDate: 29/07/2015
R16 R76 R91 R94 = R0402_68K_1%_0.0625W_100PPM: Resistor - 1%; Part Description: General Purpose Thick Film Chip Resistor; Manufacturer: GENERIC; Manufacturer1 Part Number: 232270676803L; TC: ±100ppm/°C; PressFit: No; Part Number: R0402_68K_1%_0.0625W_100PPM; Component Kind: Standard; Component Type: Standard; Pin Count: 2; Value: 68k; Status: Not Recommended; Power: 0.0625W; Tolerance: ±1%; Manufacturer Part Number: R0402_68K_1%_0.0625W_100PPM; Case: 0402; Mounted: Yes; Sense: No; Socket: No; SMD: Yes; Manufacturer1 Example: YAGEO PHYCOMP; Manufacturer1 ComponentHeight: 0.4mm; HelpURL: \\cern.ch\dfs\Applications\Altium\Datasheets\R0402_Phycomp_RC0402.pdf; Author: CERN DEM JLC; CreateDate: 03/12/2007; LatestRevisionDate: 17/10/2012
R18 = R0402_43K_1%_0.0625W_100PPM: Resistor - 1%; Part Description: General Purpose Thick Film Chip Resistor; Manufacturer: GENERIC; Manufacturer1 Part Number: 232270674303L; TC: ±100ppm/°C; PressFit: No; Part Number: R0402_43K_1%_0.0625W_100PPM; Component Kind: Standard; Component Type: Standard; Pin Count: 2; Value: 43k; Status: Not Recommended; Power: 0.0625W; Tolerance: ±1%; Manufacturer Part Number: R0402_43K_1%_0.0625W_100PPM; Case: 0402; Mounted: Yes; Sense: No; Socket: No; SMD: Yes; Manufacturer1 Example: YAGEO PHYCOMP; Manufacturer1 ComponentHeight: 0.4mm; HelpURL: \\cern.ch\dfs\Applications\Altium\Datasheets\R0402_Phycomp_RC0402.pdf; Author: CERN DEM JLC; CreateDate: 03/12/2007; LatestRevisionDate: 17/10/2012
R20 = R1206_0R005_1%_1W_100PPM_TT_LRMAM1206: Resistor - 1%; Part Description: Low Value Metal Alloy Resistor; Manufacturer: TT Electronics; Manufacturer Part Number: LRMAM1206-R005FT5; Power: 1W; TC: ±100ppm/°C; PressFit: No; Part Number: R1206_0R005_1%_1W_100PPM_TT_LRMAM1206; Component Kind: Standard; Component Type: Standard; Pin Count: 2; Value: 0R005; Status: Not Recommended; Tolerance: ±1%; Case: 1206; Mounted: Yes; Sense: No; Socket: No; SMD: Yes; ComponentHeight: 0.8mm; HelpURL: \\cern.ch\dfs\Applications\Altium\Datasheets\R1206_TT ELECTRONICS_LRMA.pdf; Author: CERN DEM BC; CreateDate: 29/07/2015; LatestRevisionDate: 29/07/2015
R23 R24 R26 R27 R45 R47 R58 R63 R70 R74 R75 R81 R83 R85 R97 R107 = R0402_10K_1%_0.0625W_100PPM: Resistor - 1%; Part Description: General Purpose Thick Film Chip Resistor; Manufacturer: GENERIC; Manufacturer1 Part Number: 232270671003L; TC: ±100ppm/°C; PressFit: No; Part Number: R0402_10K_1%_0.0625W_100PPM; Component Kind: Standard; Component Type: Standard; Pin Count: 2; Value: 10k; Status: Not Recommended; Power: 0.0625W; Tolerance: ±1%; Manufacturer Part Number: R0402_10K_1%_0.0625W_100PPM; Case: 0402; Mounted: Yes; Sense: No; Socket: No; SMD: Yes; Manufacturer1 Example: YAGEO PHYCOMP; Manufacturer1 ComponentHeight: 0.4mm; HelpURL: \\cern.ch\dfs\Applications\Altium\Datasheets\R0402_Phycomp_RC0402.pdf; Author: CERN DEM JLC
  R23 R24 R26 R27 R45 R47 R58 R63 R74 R75 R81 R83 R85 R97 R107: CreateDate: 03/12/2007; LatestRevisionDate: 17/10/2012
  R70: CreateDate: 03.12.2007; LatestRevisionDate: 17.10.2012
R28 = R0402_36K_1%_0.0625W_100PPM: Resistor - 1%; Part Description: General Purpose Thick Film Chip Resistor; Manufacturer: GENERIC; Manufacturer1 Part Number: 232270673603L; TC: ±100ppm/°C; PressFit: No; Part Number: R0402_36K_1%_0.0625W_100PPM; Component Kind: Standard; Component Type: Standard; Pin Count: 2; Value: 36k; Status: Not Recommended; Power: 0.0625W; Tolerance: ±1%; Manufacturer Part Number: R0402_36K_1%_0.0625W_100PPM; Case: 0402; Mounted: Yes; Sense: No; Socket: No; SMD: Yes; Manufacturer1 Example: YAGEO PHYCOMP; Manufacturer1 ComponentHeight: 0.4mm; HelpURL: \\cern.ch\dfs\Applications\Altium\Datasheets\R0402_Phycomp_RC0402.pdf; Author: CERN DEM JLC; CreateDate: 03/12/2007; LatestRevisionDate: 17/10/2012
R30 = R0402_15K_1%_0.0625W_100PPM: Resistor - 1%; Part Description: General Purpose Thick Film Chip Resistor; Manufacturer: GENERIC; Manufacturer1 Part Number: CRCW040215K0FKED; TC: ±100ppm/°C; PressFit: No; Part Number: R0402_15K_1%_0.0625W_100PPM; Component Kind: Standard; Component Type: Standard; Pin Count: 2; Value: 15k; Status: None; Power: 0.0625W; Tolerance: ±1%; Manufacturer Part Number: R0402_15K_1%_0.0625W_100PPM; Case: 0402; Mounted: Yes; Sense: No; Socket: No; SMD: Yes; Manufacturer1 Example: VISHAY; Manufacturer1 ComponentHeight: 0.4mm; HelpURL: \\cern.ch\dfs\Applications\Altium\Datasheets\R0402_VISHAY_CRCW e3.pdf; Author: CERN DEM JMW; CreateDate: 06/07/2015; LatestRevisionDate: 06/07/2015
R44 = R1206_0R04_1%_0.5W_100PPM_VISHAY_WSL: Resistor - 1%; Part Description: Power Metal Strip® Resistor; Manufacturer: VISHAY DALE; Manufacturer Part Number: WSL1206R0400FEA; Power: 0.5W; TC: ±100ppm/°C; PressFit: No; Part Number: R1206_0R04_1%_0.5W_100PPM_VISHAY_WSL; Component Kind: Standard; Component Type: Standard; Pin Count: 2; Value: 0R04; Status: None; Tolerance: ±1%; Case: 1206; Mounted: Yes; Sense: No; Socket: No; SMD: Yes; ComponentHeight: 0.89mm; HelpURL: \\cern.ch\dfs\Applications\Altium\Datasheets\R1206_VISHAY_WSL.pdf; Author: CERN DEM JMW; CreateDate: 06/07/2015; LatestRevisionDate: 06/07/2015
R46 R50 R53 R56 = TRIMPOT_TC33X_1M: Trimming Potentiometer, 1M Ohm, -40 to 100 degC, 3-Pin SMD, RoHS, Tape and Reel; Manufacturer: Bourns; Tolerance: 25%; Max Power Dissipation: 100mW; Number of Turns: 1; Temperature Coefficient: 250ppm/degreesC; Voltage Rating (DC): 50V; Datasheet URL: http://www.bourns.com/docs/Product-Datasheets/TC33.pdf; Composition: Potentiometer; Package Description: 3-Pin Surface Mount Device, Body 3.8 x 3.6 mm; Weight: 29.4mg; Power Rating: 100mW; Termination: FootPrint; Manufacturer URL: http://www.bourns.com/; Width: 0.118inch; Height: 0.047inch; Military Standard: Not; Radiation Hardening: No; Colour: Silver; Case/Package: SMD/SMT; Depth: 3.8mm; Min Operating Temperature: -40degC; Lead Free: LeadFree; Datasheet Version: 42583.0; REACH SVHC: NoSVHC; Length: 3mm; RoHSCompliant: true; Contact Plating: Silver; Taper: Linear; Packaging: TapeandReel; Mount: SurfaceMount; Max Operating Temperature: 100degC; Package Reference: TC33X-2; Package Quantity: 2500
R64 = R1206_0R22_1%_0.5W_100PPM: Resistor - 1%; Part Description: Thick Film Chip Resistor; Manufacturer: GENERIC; Power: 0.5W; TC: ±100ppm/°C; PressFit: No; Part Number: R1206_0R22_1%_0.5W_100PPM; Component Kind: Standard; Component Type: Standard; Pin Count: 2; Value: 0R22; Status: Not Recommended; Tolerance: ±1%; Manufacturer Part Number: R1206_0R22_1%_0.5W_100PPM; Case: 1206; Mounted: Yes; Sense: No; Socket: No; SMD: Yes; Manufacturer1 Example: VISHAY DALE; Manufacturer1 ComponentHeight: 0.7mm; HelpURL: \\cern.ch\dfs\Applications\Altium\Datasheets\R1206_VISHAY_RCWE.pdf; Author: CERN DEM JLC; CreateDate: 16.08.2012; LatestRevisionDate: 16.08.2012
R65 R87 R110 R156 = R0402_100K_1%_0.0625W_100PPM: Resistor - 1%; Part Description: General Purpose Thick Film Chip Resistor; Manufacturer: GENERIC; Manufacturer1 Part Number: 232270671004L; TC: ±100ppm/°C; PressFit: No; Part Number: R0402_100K_1%_0.0625W_100PPM; Component Kind: Standard; Component Type: Standard; Pin Count: 2; Value: 100k; Status: Not Recommended; Power: 0.0625W; Tolerance: ±1%; Manufacturer Part Number: R0402_100K_1%_0.0625W_100PPM; Case: 0402; Mounted: Yes; Sense: No; Socket: No; SMD: Yes; Manufacturer1 Example: YAGEO PHYCOMP; Manufacturer1 ComponentHeight: 0.4mm; HelpURL: \\cern.ch\dfs\Applications\Altium\Datasheets\R0402_Phycomp_RC0402.pdf; Author: CERN DEM JLC
  R65: CreateDate: 03/12/2007; LatestRevisionDate: 17/10/2012
  R87 R110 R156: CreateDate: 03.12.2007; LatestRevisionDate: 17.10.2012
R72 R93 = R0402_18K_1%_0.0625W_100PPM: Resistor - 1%; Part Description: General Purpose Thick Film Chip Resistor; Manufacturer: GENERIC; Manufacturer1 Part Number: 232270671803L; TC: ±100ppm/°C; PressFit: No; Part Number: R0402_18K_1%_0.0625W_100PPM; Component Kind: Standard; Component Type: Standard; Pin Count: 2; Value: 18k; Status: Not Recommended; Power: 0.0625W; Tolerance: ±1%; Manufacturer Part Number: R0402_18K_1%_0.0625W_100PPM; Case: 0402; Mounted: Yes; Sense: No; Socket: No; SMD: Yes; Manufacturer1 Example: YAGEO PHYCOMP; Manufacturer1 ComponentHeight: 0.4mm; HelpURL: \\cern.ch\dfs\Applications\Altium\Datasheets\R0402_Phycomp_RC0402.pdf; Author: CERN DEM JLC
  R72: CreateDate: 03/12/2007; LatestRevisionDate: 17/10/2012
  R93: CreateDate: 03.12.2007; LatestRevisionDate: 17.10.2012
R73 = R0402_240K_1%_0.0625W_100PPM: Resistor - 1%; Part Description: General Purpose Thick Film Chip Resistor; Manufacturer: GENERIC; Manufacturer1 Part Number: 232270672404L; TC: ±100ppm/°C; PressFit: No; Part Number: R0402_240K_1%_0.0625W_100PPM; Component Kind: Standard; Component Type: Standard; Pin Count: 2; Value: 240k; Status: Not Recommended; Power: 0.0625W; Tolerance: ±1%; Manufacturer Part Number: R0402_240K_1%_0.0625W_100PPM; Case: 0402; Mounted: Yes; Sense: No; Socket: No; SMD: Yes; Manufacturer1 Example: YAGEO PHYCOMP; Manufacturer1 ComponentHeight: 0.4mm; HelpURL: \\cern.ch\dfs\Applications\Altium\Datasheets\R0402_Phycomp_RC0402.pdf; Author: CERN DEM JLC; CreateDate: 03/12/2007; LatestRevisionDate: 17/10/2012
R79 R193-R195 = R0402_24K_1%_0.0625W_100PPM: Resistor - 1%; Part Description: General Purpose Thick Film Chip Resistor; Manufacturer: GENERIC; Manufacturer1 Part Number: 232270672403L; TC: ±100ppm/°C; PressFit: No; Part Number: R0402_24K_1%_0.0625W_100PPM; Component Kind: Standard; Component Type: Standard; Pin Count: 2; Value: 24k; Status: Not Recommended; Power: 0.0625W; Tolerance: ±1%; Manufacturer Part Number: R0402_24K_1%_0.0625W_100PPM; Case: 0402; Mounted: Yes; Sense: No; Socket: No; SMD: Yes; Manufacturer1 Example: YAGEO PHYCOMP; Manufacturer1 ComponentHeight: 0.4mm; HelpURL: \\cern.ch\dfs\Applications\Altium\Datasheets\R0402_Phycomp_RC0402.pdf; Author: CERN DEM JLC
  R79: CreateDate: 03/12/2007; LatestRevisionDate: 17/10/2012
  R193-R195: CreateDate: 03.12.2007; LatestRevisionDate: 17.10.2012
R80 = R0402_75K_1%_0.0625W_100PPM: Resistor - 1%; Part Description: General Purpose Thick Film Chip Resistor; Manufacturer: GENERIC; Manufacturer1 Part Number: 232270677503L; TC: ±100ppm/°C; PressFit: No; Part Number: R0402_75K_1%_0.0625W_100PPM; Component Kind: Standard; Component Type: Standard; Pin Count: 2; Value: 75k; Status: Not Recommended; Power: 0.0625W; Tolerance: ±1%; Manufacturer Part Number: R0402_75K_1%_0.0625W_100PPM; Case: 0402; Mounted: Yes; Sense: No; Socket: No; SMD: Yes; Manufacturer1 Example: YAGEO PHYCOMP; Manufacturer1 ComponentHeight: 0.4mm; HelpURL: \\cern.ch\dfs\Applications\Altium\Datasheets\R0402_Phycomp_RC0402.pdf; Author: CERN DEM JLC; CreateDate: 03/12/2007; LatestRevisionDate: 17/10/2012
R88 = R0402_47K_1%_0.0625W_100PPM: Resistor - 1%; Part Description: General Purpose Thick Film Chip Resistor; Manufacturer: GENERIC; Manufacturer1 Part Number: 232270675103L; TC: ±100ppm/°C; PressFit: No; Part Number: R0402_47K_1%_0.0625W_100PPM; Component Kind: Standard; Component Type: Standard; Pin Count: 2; Value: 47k; Status: Not Recommended; Power: 0.0625W; Tolerance: ±1%; Manufacturer Part Number: R0402_47K_1%_0.0625W_100PPM; Case: 0402; Mounted: Yes; Sense: No; Socket: No; SMD: Yes; Manufacturer1 Example: YAGEO PHYCOMP; Manufacturer1 ComponentHeight: 0.4mm; HelpURL: \\cern.ch\dfs\Applications\Altium\Datasheets\R0402_Phycomp_RC0402.pdf; Author: CERN DEM JLC; CreateDate: 03/12/2007; LatestRevisionDate: 17/10/2012
R90 = R0402_62K_1%_0.0625W_100PPM: Resistor - 1%; Part Description: General Purpose Thick Film Chip Resistor; Manufacturer: GENERIC; Manufacturer1 Part Number: 232270676203L; TC: ±100ppm/°C; PressFit: No; Part Number: R0402_62K_1%_0.0625W_100PPM; Component Kind: Standard; Component Type: Standard; Pin Count: 2; Value: 62k; Status: Not Recommended; Power: 0.0625W; Tolerance: ±1%; Manufacturer Part Number: R0402_62K_1%_0.0625W_100PPM; Case: 0402; Mounted: Yes; Sense: No; Socket: No; SMD: Yes; Manufacturer1 Example: YAGEO PHYCOMP; Manufacturer1 ComponentHeight: 0.4mm; HelpURL: \\cern.ch\dfs\Applications\Altium\Datasheets\R0402_Phycomp_RC0402.pdf; Author: CERN DEM JLC; CreateDate: 03/12/2007; LatestRevisionDate: 17/10/2012
R192 R196 = R0402_3K6_1%_0.0625W_100PPM: Resistor - 1%; Part Description: General Purpose Thick Film Chip Resistor; Manufacturer: GENERIC; Manufacturer1 Part Number: 232270673602L; TC: ±100ppm/°C; PressFit: No; Part Number: R0402_3K6_1%_0.0625W_100PPM; Component Kind: Standard; Component Type: Standard; Pin Count: 2; Value: 3k6; Status: Not Recommended; Power: 0.0625W; Tolerance: ±1%; Manufacturer Part Number: R0402_3K6_1%_0.0625W_100PPM; Case: 0402; Mounted: Yes; Sense: No; Socket: No; SMD: Yes; Manufacturer1 Example: YAGEO PHYCOMP; Manufacturer1 ComponentHeight: 0.4mm; HelpURL: \\cern.ch\dfs\Applications\Altium\Datasheets\R0402_Phycomp_RC0402.pdf; Author: CERN DEM JLC; CreateDate: 03.12.2007; LatestRevisionDate: 17.10.2012
T3 = 2N7002BKS: 60V, 300mA Dual N-Channel Trench MOSFET; Manufacturer: NXP SEMICONDUCTORS; Manufacturer Part Number: 2N7002BKS6; PressFit: No; Bonding: No; Part Number: 2N7002BKS; Component Kind: Standard; Component Type: Standard; Device: 2N7002BKS; PackageDescription: SOT363, SC70-6, SOT, 0.65mm Pitch, 6 pin, 1.25mm W X 2.00mm L X 1.10mm H, IPC Medium Density; Part Description: 60 V, 300 mA Dual N-Channel Trench MOSFET; Pin Count: 4; Case: SOT363; Mounted: Yes; Socket: No; SMD: Yes; Sense: No; ComponentHeight: 1.1mm; HelpURL: \\cern.ch\dfs\Applications\Altium\Datasheets\2N7002BKS.pdf; Author: CERN DEM JLC; CreateDate: 2012-11-27; LatestRevisionDate: 2012-11-27
TP9-TP14 = SMD_PAD_1.27X1.27MM: Part Description: 1.27mm x 1.27mm PCB Copper Area (SMD Test Point); Mounted: No; Part Number: SMD_PAD_1.27X1.27MM; Component Kind: Standard (No BOM); Component Type: Standard (No BOM); Pin Count: 1; Family: Test Point; Socket: No; SMD: Yes; Sense: No; Status: None; ComponentHeight: 0mm; HelpURL: Undefined; Author: CERN DEM JLC; CreateDate: 12.01.2008; LatestRevisionDate: 12.01.2008; PackageDescription: 1.27mm x 1.27mm PCB Copper Area (SMD Test Point)
U1 U3 U6 U7 = CMP-0491-01209-1: 2.5 A Synchronous Step-Down Regulator 2.5 uA Quiescent Current, 16-pin SOP (MSE-16-EDP), -40 to 125 degC; Manufacturer: Linear Technology; Number of Outputs: 1; Frequency Adjust Range: 200kHz - 2.2MHz; ComponentLink1URL: http://www.linear.com/; PackageVersion: Rev. F, 05/2013; PackageDescription: 16-Pin Plastic MSOP, Exposed Die Pad, Body 4.039 x 3 mm, Pitch 0.5 mm; ComponentLink3URL: http://cds.linear.com/docs/en/packaging/05081667_F_MSE16.pdf; ComponentLink2Description: Datasheet; PackageReference: MSE-16; Mounting Technology: Surface Mount; PartNumber: LT8610IMSE; RoHS: FALSE; ComponentLink3Description: Package Specification; ComponentLink1Description: Manufacturer URL; ComponentLink2URL: http://cds.linear.com/docs/en/datasheet/8610f.pdf